# Altium project target_LED_ring_5050.PrjPcb
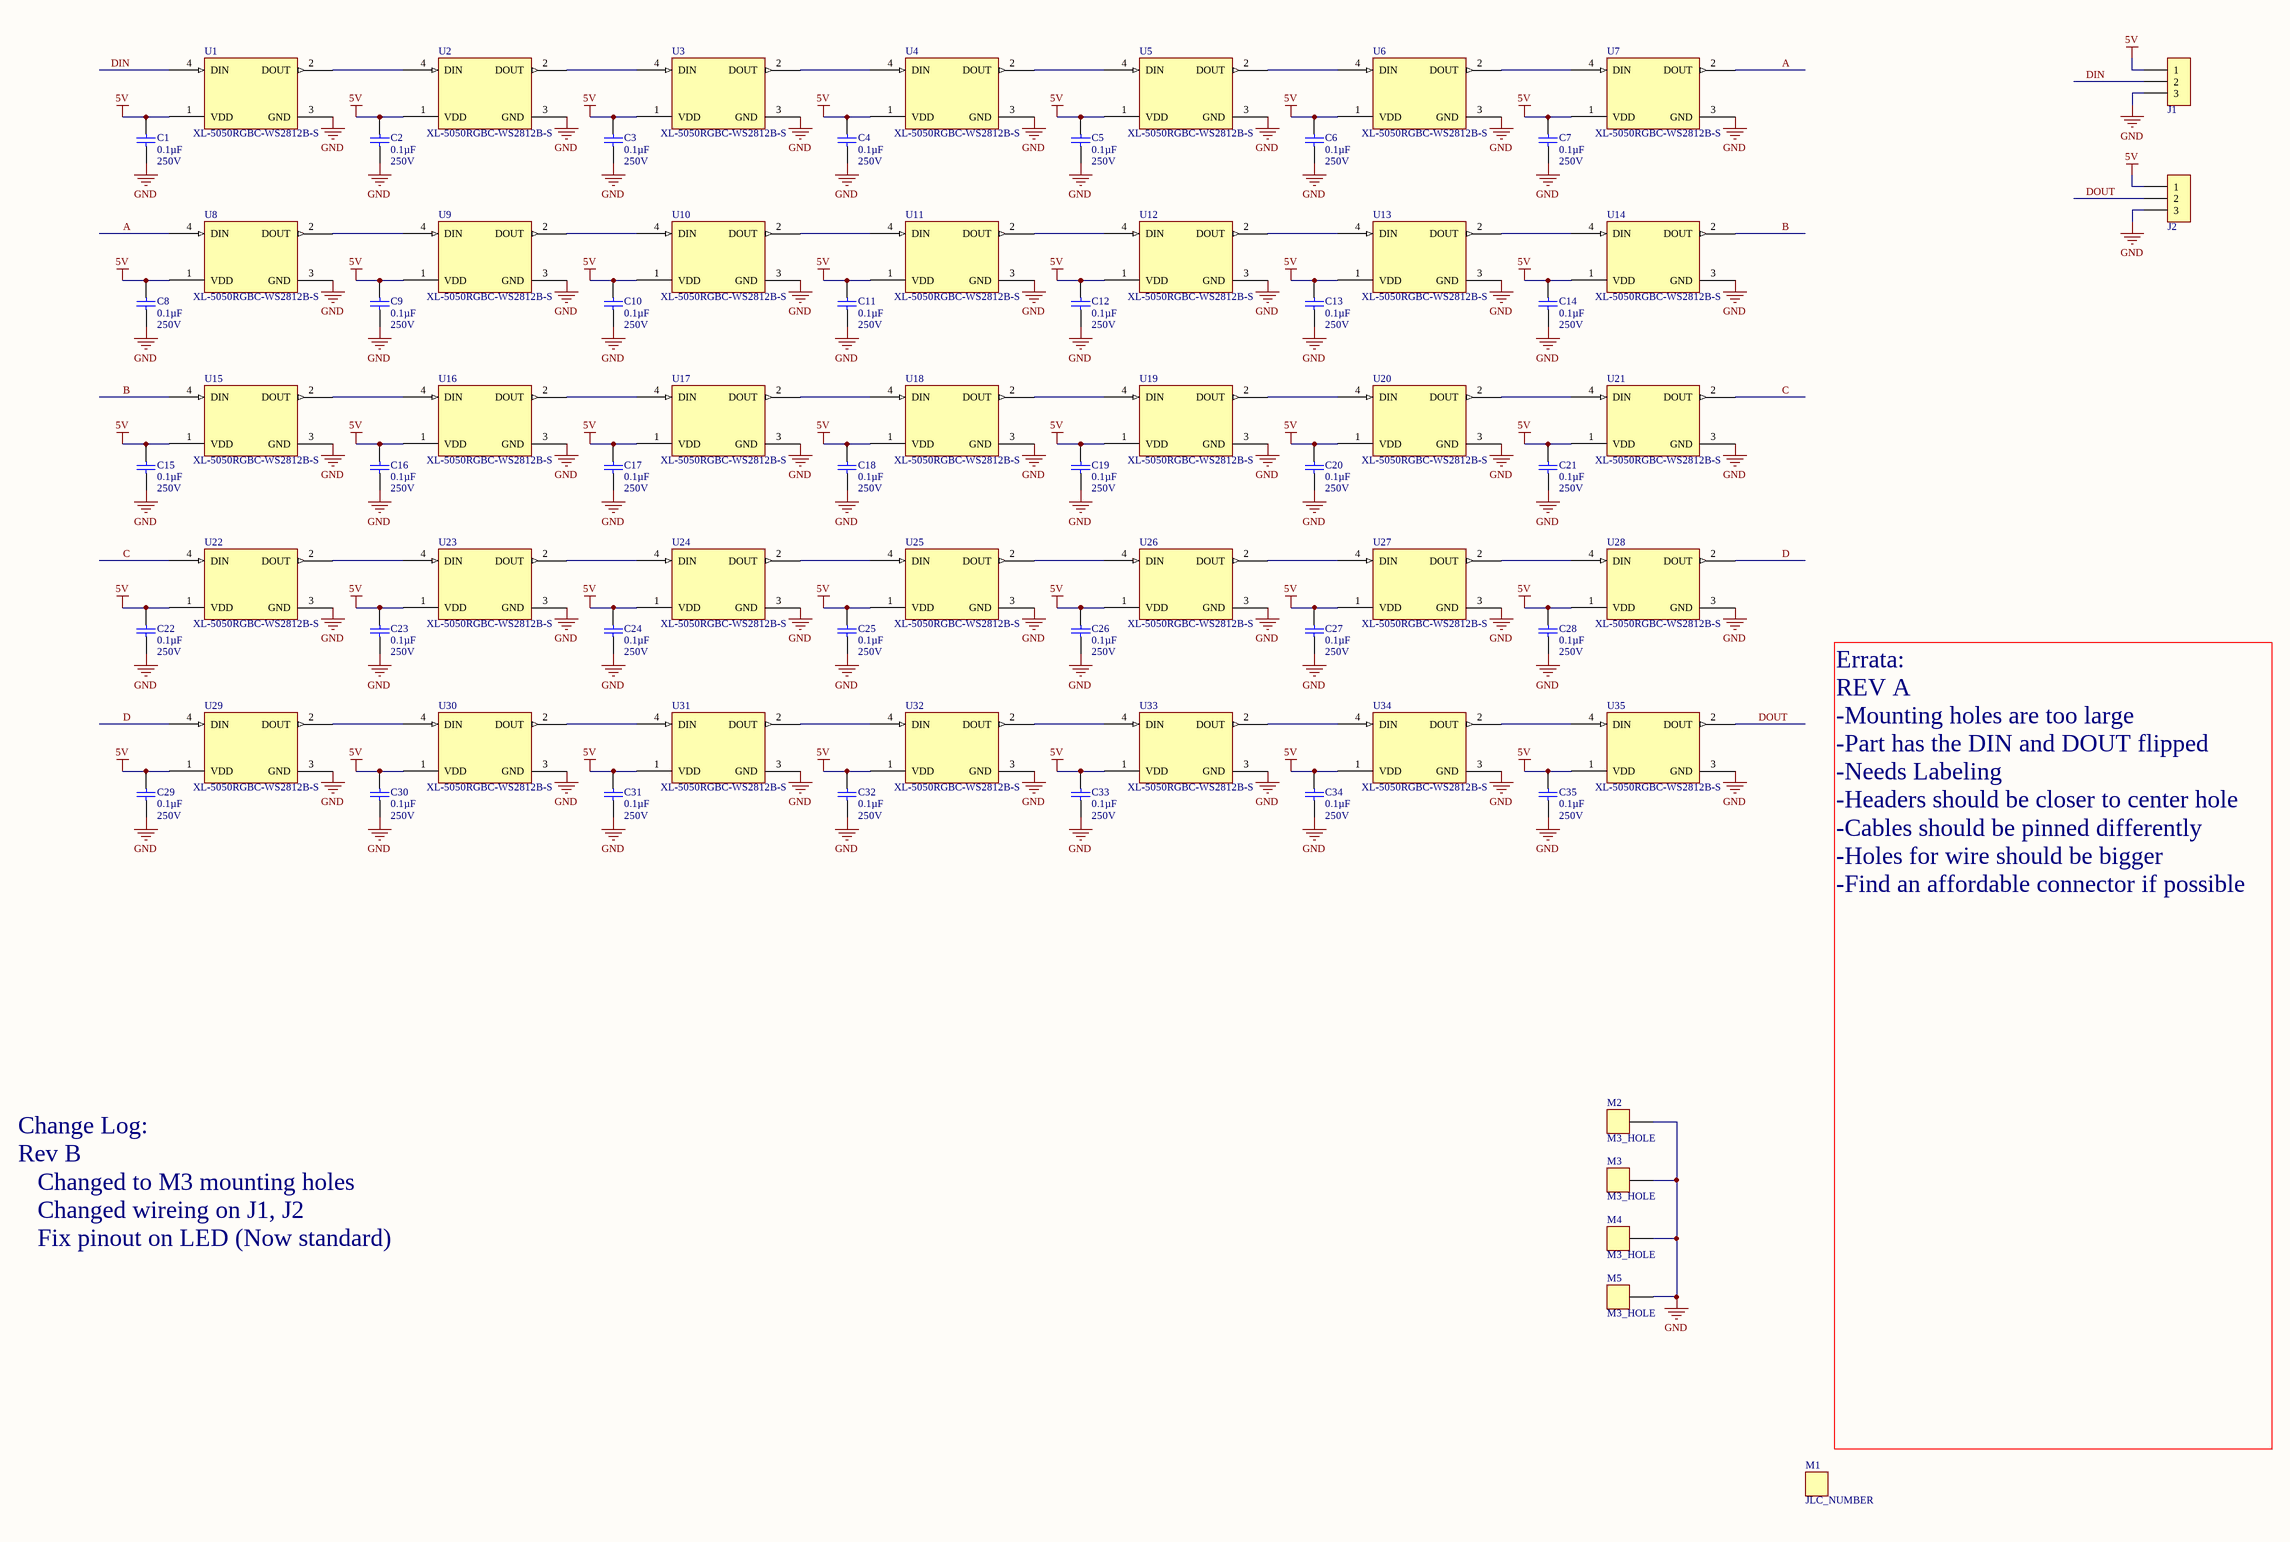
[diagram p0: target_LED_ring_5050.SchDoc]
LeadEngineer: JCF; HardRev: C; Codename: target_LED_ring_5050; BOMRev: C
1 sheet, 77 parts. Net scope: global (net labels, ports and power ports of the same name join across sheets).
Board file: target_LED_ring_5050.PcbDoc

## Sheet target_LED_ring_5050.SchDoc: Pico
size C; DocumentNumber: 1; SheetNumber: 1; SheetTotal: 1

### Parts
C1  0.1µF  Voltage: 250V  [Chip0805]
C2  0.1µF  Voltage: 250V  [Chip0805]
C3  0.1µF  Voltage: 250V  [Chip0805]
C4  0.1µF  Voltage: 250V  [Chip0805]
C5  0.1µF  Voltage: 250V  [Chip0805]
C6  0.1µF  Voltage: 250V  [Chip0805]
C7  0.1µF  Voltage: 250V  [Chip0805]
C8  0.1µF  Voltage: 250V  [Chip0805]
C9  0.1µF  Voltage: 250V  [Chip0805]
C10  0.1µF  Voltage: 250V  [Chip0805]
C11  0.1µF  Voltage: 250V  [Chip0805]
C12  0.1µF  Voltage: 250V  [Chip0805]
C13  0.1µF  Voltage: 250V  [Chip0805]
C14  0.1µF  Voltage: 250V  [Chip0805]
C15  0.1µF  Voltage: 250V  [Chip0805]
C16  0.1µF  Voltage: 250V  [Chip0805]
C17  0.1µF  Voltage: 250V  [Chip0805]
C18  0.1µF  Voltage: 250V  [Chip0805]
C19  0.1µF  Voltage: 250V  [Chip0805]
C20  0.1µF  Voltage: 250V  [Chip0805]
C21  0.1µF  Voltage: 250V  [Chip0805]
C22  0.1µF  Voltage: 250V  [Chip0805]
C23  0.1µF  Voltage: 250V  [Chip0805]
C24  0.1µF  Voltage: 250V  [Chip0805]
C25  0.1µF  Voltage: 250V  [Chip0805]
C26  0.1µF  Voltage: 250V  [Chip0805]
C27  0.1µF  Voltage: 250V  [Chip0805]
C28  0.1µF  Voltage: 250V  [Chip0805]
C29  0.1µF  Voltage: 250V  [Chip0805]
C30  0.1µF  Voltage: 250V  [Chip0805]
C31  0.1µF  Voltage: 250V  [Chip0805]
C32  0.1µF  Voltage: 250V  [Chip0805]
C33  0.1µF  Voltage: 250V  [Chip0805]
C34  0.1µF  Voltage: 250V  [Chip0805]
C35  0.1µF  Voltage: 250V  [Chip0805]
J1  3-644456-3  [TE_3-644456-3]  (value not drawn)
J2  3-644456-3  [TE_3-644456-3]  (value not drawn)
M1  JLC_NUMBER  [JLC_NUMBER]  (no BOM)
M2  M3_HOLE  [M3_HOLE]  (no BOM)
M3  M3_HOLE  [M3_HOLE]  (no BOM)
M4  M3_HOLE  [M3_HOLE]  (no BOM)
M5  M3_HOLE  [M3_HOLE]  (no BOM)
U1  XL-5050RGBC-WS2812B-S  [XINGLIGHT_XL-5050RGBC-WS2812B-S]
U2  XL-5050RGBC-WS2812B-S  [XINGLIGHT_XL-5050RGBC-WS2812B-S]
U3  XL-5050RGBC-WS2812B-S  [XINGLIGHT_XL-5050RGBC-WS2812B-S]
U4  XL-5050RGBC-WS2812B-S  [XINGLIGHT_XL-5050RGBC-WS2812B-S]
U5  XL-5050RGBC-WS2812B-S  [XINGLIGHT_XL-5050RGBC-WS2812B-S]
U6  XL-5050RGBC-WS2812B-S  [XINGLIGHT_XL-5050RGBC-WS2812B-S]
U7  XL-5050RGBC-WS2812B-S  [XINGLIGHT_XL-5050RGBC-WS2812B-S]
U8  XL-5050RGBC-WS2812B-S  [XINGLIGHT_XL-5050RGBC-WS2812B-S]
U9  XL-5050RGBC-WS2812B-S  [XINGLIGHT_XL-5050RGBC-WS2812B-S]
U10  XL-5050RGBC-WS2812B-S  [XINGLIGHT_XL-5050RGBC-WS2812B-S]
U11  XL-5050RGBC-WS2812B-S  [XINGLIGHT_XL-5050RGBC-WS2812B-S]
U12  XL-5050RGBC-WS2812B-S  [XINGLIGHT_XL-5050RGBC-WS2812B-S]
U13  XL-5050RGBC-WS2812B-S  [XINGLIGHT_XL-5050RGBC-WS2812B-S]
U14  XL-5050RGBC-WS2812B-S  [XINGLIGHT_XL-5050RGBC-WS2812B-S]
U15  XL-5050RGBC-WS2812B-S  [XINGLIGHT_XL-5050RGBC-WS2812B-S]
U16  XL-5050RGBC-WS2812B-S  [XINGLIGHT_XL-5050RGBC-WS2812B-S]
U17  XL-5050RGBC-WS2812B-S  [XINGLIGHT_XL-5050RGBC-WS2812B-S]
U18  XL-5050RGBC-WS2812B-S  [XINGLIGHT_XL-5050RGBC-WS2812B-S]
U19  XL-5050RGBC-WS2812B-S  [XINGLIGHT_XL-5050RGBC-WS2812B-S]
U20  XL-5050RGBC-WS2812B-S  [XINGLIGHT_XL-5050RGBC-WS2812B-S]
U21  XL-5050RGBC-WS2812B-S  [XINGLIGHT_XL-5050RGBC-WS2812B-S]
U22  XL-5050RGBC-WS2812B-S  [XINGLIGHT_XL-5050RGBC-WS2812B-S]
U23  XL-5050RGBC-WS2812B-S  [XINGLIGHT_XL-5050RGBC-WS2812B-S]
U24  XL-5050RGBC-WS2812B-S  [XINGLIGHT_XL-5050RGBC-WS2812B-S]
U25  XL-5050RGBC-WS2812B-S  [XINGLIGHT_XL-5050RGBC-WS2812B-S]
U26  XL-5050RGBC-WS2812B-S  [XINGLIGHT_XL-5050RGBC-WS2812B-S]
U27  XL-5050RGBC-WS2812B-S  [XINGLIGHT_XL-5050RGBC-WS2812B-S]
U28  XL-5050RGBC-WS2812B-S  [XINGLIGHT_XL-5050RGBC-WS2812B-S]
U29  XL-5050RGBC-WS2812B-S  [XINGLIGHT_XL-5050RGBC-WS2812B-S]
U30  XL-5050RGBC-WS2812B-S  [XINGLIGHT_XL-5050RGBC-WS2812B-S]
U31  XL-5050RGBC-WS2812B-S  [XINGLIGHT_XL-5050RGBC-WS2812B-S]
U32  XL-5050RGBC-WS2812B-S  [XINGLIGHT_XL-5050RGBC-WS2812B-S]
U33  XL-5050RGBC-WS2812B-S  [XINGLIGHT_XL-5050RGBC-WS2812B-S]
U34  XL-5050RGBC-WS2812B-S  [XINGLIGHT_XL-5050RGBC-WS2812B-S]
U35  XL-5050RGBC-WS2812B-S  [XINGLIGHT_XL-5050RGBC-WS2812B-S]

### Nets
5V: C1.2 C2.2 C3.2 C4.2 C5.2 C6.2 C7.2 C8.2 C9.2 C10.2 C11.2 C12.2 C13.2 C14.2 C15.2 C16.2 C17.2 C18.2 C19.2 C20.2 C21.2 C22.2 C23.2 C24.2 C25.2 C26.2 C27.2 C28.2 C29.2 C30.2 C31.2 C32.2 C33.2 C34.2 C35.2 J1.1 J2.1 U1.1(VDD) U2.1(VDD) U3.1(VDD) U4.1(VDD) U5.1(VDD) U6.1(VDD) U7.1(VDD) U8.1(VDD) U9.1(VDD) U10.1(VDD) U11.1(VDD) U12.1(VDD) U13.1(VDD) U14.1(VDD) U15.1(VDD) U16.1(VDD) U17.1(VDD) U18.1(VDD) U19.1(VDD) U20.1(VDD) U21.1(VDD) U22.1(VDD) U23.1(VDD) U24.1(VDD) U25.1(VDD) U26.1(VDD) U27.1(VDD) U28.1(VDD) U29.1(VDD) U30.1(VDD) U31.1(VDD) U32.1(VDD) U33.1(VDD) U34.1(VDD) U35.1(VDD)
GND: C1.1 C2.1 C3.1 C4.1 C5.1 C6.1 C7.1 C8.1 C9.1 C10.1 C11.1 C12.1 C13.1 C14.1 C15.1 C16.1 C17.1 C18.1 C19.1 C20.1 C21.1 C22.1 C23.1 C24.1 C25.1 C26.1 C27.1 C28.1 C29.1 C30.1 C31.1 C32.1 C33.1 C34.1 C35.1 J1.3 J2.3 M2.1 M3.1 M4.1 M5.1 U1.3(GND) U2.3(GND) U3.3(GND) U4.3(GND) U5.3(GND) U6.3(GND) U7.3(GND) U8.3(GND) U9.3(GND) U10.3(GND) U11.3(GND) U12.3(GND) U13.3(GND) U14.3(GND) U15.3(GND) U16.3(GND) U17.3(GND) U18.3(GND) U19.3(GND) U20.3(GND) U21.3(GND) U22.3(GND) U23.3(GND) U24.3(GND) U25.3(GND) U26.3(GND) U27.3(GND) U28.3(GND) U29.3(GND) U30.3(GND) U31.3(GND) U32.3(GND) U33.3(GND) U34.3(GND) U35.3(GND)
A: U7.2(DOUT) U8.4(DIN)
B: U14.2(DOUT) U15.4(DIN)
C: U21.2(DOUT) U22.4(DIN)
D: U28.2(DOUT) U29.4(DIN)
DIN: J1.2 U1.4(DIN)
DOUT: J2.2 U35.2(DOUT)
NetU1_2: U1.2(DOUT) U2.4(DIN)
NetU2_2: U2.2(DOUT) U3.4(DIN)
NetU3_2: U3.2(DOUT) U4.4(DIN)
NetU4_2: U4.2(DOUT) U5.4(DIN)
NetU5_2: U5.2(DOUT) U6.4(DIN)
NetU6_2: U6.2(DOUT) U7.4(DIN)
NetU8_2: U8.2(DOUT) U9.4(DIN)
NetU9_2: U9.2(DOUT) U10.4(DIN)
NetU10_2: U10.2(DOUT) U11.4(DIN)
NetU11_2: U11.2(DOUT) U12.4(DIN)
NetU12_2: U12.2(DOUT) U13.4(DIN)
NetU13_2: U13.2(DOUT) U14.4(DIN)
NetU15_2: U15.2(DOUT) U16.4(DIN)
NetU16_2: U16.2(DOUT) U17.4(DIN)
NetU17_2: U17.2(DOUT) U18.4(DIN)
NetU18_2: U18.2(DOUT) U19.4(DIN)
NetU19_2: U19.2(DOUT) U20.4(DIN)
NetU20_2: U20.2(DOUT) U21.4(DIN)
NetU22_2: U22.2(DOUT) U23.4(DIN)
NetU23_2: U23.2(DOUT) U24.4(DIN)
NetU24_2: U24.2(DOUT) U25.4(DIN)
NetU25_2: U25.2(DOUT) U26.4(DIN)
NetU26_2: U26.2(DOUT) U27.4(DIN)
NetU27_2: U27.2(DOUT) U28.4(DIN)
NetU29_2: U29.2(DOUT) U30.4(DIN)
NetU30_2: U30.2(DOUT) U31.4(DIN)
NetU31_2: U31.2(DOUT) U32.4(DIN)
NetU32_2: U32.2(DOUT) U33.4(DIN)
NetU33_2: U33.2(DOUT) U34.4(DIN)
NetU34_2: U34.2(DOUT) U35.4(DIN)

### Notes on the sheet
- Errata:
  REV A
  -Mounting holes are too large
  -Part has the DIN and DOUT flipped
  -Needs Labeling
  -Headers should be closer to center hole
  -Cables should be pinned differently
  -Holes for wire should be bigger
  -Find an affordable connector if possible
- Change Log:
  Rev B
  Changed to M3 mounting holes
  Changed wireing on J1, J2
  Fix pinout on LED (Now standard)
- Title:
- This work is licensed under a Creative Commons Attribution 4.0 International License. Derivative works should remove all Sophistry branding and ‘é’ watermark.
- Date:
- Engineer:
- Revision:
- Codename:
- Time:
- Variant:
- Sheet
- of

### Library data of the parts
C1-C35 = C2012X7T2E104K125AA: CAP CER 0.1UF 250V 10% X7T 0805; Manufacturer: TDK Corporation; PartNumber: C2012X7T2E104K125AA; HelpURL: http://product.tdk.com/capacitor/mlcc/en/documents/mlcc_commercial_midvoltage_en.pdf; Supplier 1: Digi-Key; Supplier Part Number 1: 445-7749-1-ND; Supplier 2: Mouser; Manufacturer Part Number: C2012X7T2E104K125AA; Series: C; Capacitance: 0.1µF; Tolerance: ±10%; Temperature Coefficient: X7T; Mounting Type: Surface Mount, MLCC; Operating Temperature: -55°C ~ 125°C; Applications: General Purpose; Ratings: -; Package / Case: 0805 (2012 Metric); Size / Dimension: 0.079" L x 0.049" W (2.00mm x 1.25mm); Height - Seated (Max): -; Thickness (Max): 0.057" (1.45mm); Lead Spacing: -; Features: -; Lead Style: -
J1 J2 = 3-644456-3: CONN HEADER VERT 3POS .100 TIN; Manufacturer: TE Connectivity; PartNumber: 3-644456-3; Supplier 1: Digi-Key; Supplier 2: Mouser; Supplier Part Number 2: 571-3-644456-3; HelpURL: http://www.te.com/commerce/DocumentDelivery/DDEController?Action=srchrtrv&DocNm=644456&DocType=Customer+Drawing&DocLang=English; Supplier Part Number 1: A31113-ND; Manufacturer Part Number: 3-644456-3
M1 = JLC_NUMBER: JLC Order Number Location; PartNumber: JLC_NUMBER; Manufacturer Part Number: JLC_NUMBER
U1-U35 = XL-5050RGBC-WS2812B-S: Addressable RGB LED; Manufacturer: XINGLIGHT; PartNumber: XL-5050RGBC-WS2812B-S; Datasheets: https://www.lcsc.com/datasheet/lcsc_datasheet_2406131538_XINGLIGHT-XL-5050RGBC-WS2812B-S_C22461793.pdf; Supplier 1: Digi-Key; Supplier 2: Mouser; Supplier 3: LCSC; Supplier Part Number 3: C22461793; Manufacturer Part Number: XL-5050RGBC-WS2812B-S
M2-M5 = M3_HOLE: PartNumber: M3_HOLE; Manufacturer Part Number: M3_HOLE